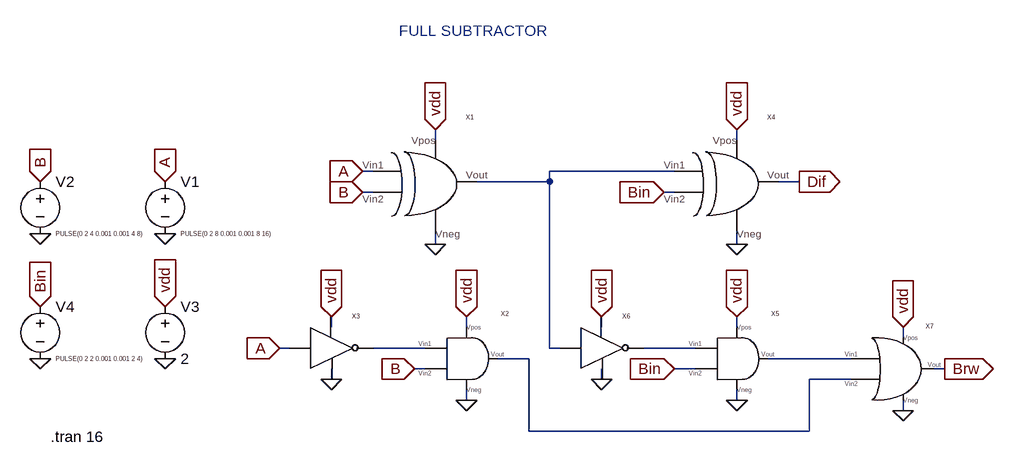
[diagram p0: schematic FULL SUB.asc]
FULL SUB.asc, the LTspice schematic file:
Version 4
SHEET 1 1320 680
WIRE 352 -80 352 -96
WIRE 816 -80 816 -96
WIRE 256 -32 240 -32
WIRE 720 -32 528 -32
WIRE 528 -16 528 -32
WIRE 528 -16 416 -16
WIRE 912 -16 880 -16
WIRE 256 0 240 0
WIRE 720 0 704 0
WIRE 352 80 352 64
WIRE 816 80 816 64
WIRE 192 208 192 192
WIRE 400 208 400 192
WIRE 608 208 608 192
WIRE 816 208 816 192
WIRE 1072 224 1072 208
WIRE 128 240 112 240
WIRE 336 240 256 240
WIRE 528 240 528 -16
WIRE 544 240 528 240
WIRE 752 240 672 240
WIRE 496 256 448 256
WIRE 992 256 864 256
WIRE 336 272 320 272
WIRE 752 272 720 272
WIRE 1136 272 1120 272
WIRE 192 288 192 272
WIRE 608 288 608 272
WIRE 992 288 928 288
WIRE 400 320 400 304
WIRE 816 320 816 304
WIRE 1072 336 1072 320
WIRE 496 368 496 256
WIRE 928 368 928 288
WIRE 928 368 496 368
FLAG 240 -32 A
IOPIN 240 -32 In
FLAG -64 -16 A
IOPIN -64 -16 In
FLAG 112 240 A
IOPIN 112 240 In
FLAG 240 0 B
IOPIN 240 0 In
FLAG -256 -16 B
IOPIN -256 -16 In
FLAG 320 272 B
IOPIN 320 272 In
FLAG 352 -96 vdd
IOPIN 352 -96 In
FLAG -64 176 vdd
IOPIN -64 176 In
FLAG 400 192 vdd
IOPIN 400 192 In
FLAG 192 192 vdd
IOPIN 192 192 In
FLAG 352 80 0
FLAG 400 320 0
FLAG 192 288 0
FLAG -64 256 0
FLAG -256 64 0
FLAG -64 64 0
FLAG 816 -96 vdd
IOPIN 816 -96 In
FLAG 816 192 vdd
IOPIN 816 192 In
FLAG 608 192 vdd
IOPIN 608 192 In
FLAG 816 80 0
FLAG 816 320 0
FLAG 608 288 0
FLAG 912 -16 Dif
IOPIN 912 -16 Out
FLAG -256 256 0
FLAG -256 176 Bin
IOPIN -256 176 In
FLAG 704 0 Bin
IOPIN 704 0 In
FLAG 720 272 Bin
IOPIN 720 272 In
FLAG 1072 208 vdd
IOPIN 1072 208 In
FLAG 1136 272 Brw
IOPIN 1136 272 Out
FLAG 1072 336 0
SYMBOL xor 400 -32 R0
SYMATTR InstName X1
SYMBOL and 432 256 R0
SYMATTR InstName X2
SYMBOL inverter 192 256 R0
SYMATTR InstName X3
SYMBOL voltage -64 -32 R0
WINDOW 3 24 96 Left 0
WINDOW 123 0 0 Left 0
WINDOW 39 0 0 Left 0
SYMATTR Value PULSE(0 2 8 0.001 0.001 8 16)
SYMATTR InstName V1
SYMBOL voltage -256 -32 R0
WINDOW 3 24 96 Left 0
WINDOW 123 0 0 Left 0
WINDOW 39 0 0 Left 0
SYMATTR Value PULSE(0 2 4 0.001 0.001 4 8)
SYMATTR InstName V2
SYMBOL voltage -64 160 R0
WINDOW 123 0 0 Left 0
WINDOW 39 0 0 Left 0
SYMATTR InstName V3
SYMATTR Value 2
SYMBOL xor 864 -32 R0
SYMATTR InstName X4
SYMBOL and 848 256 R0
SYMATTR InstName X5
SYMBOL inverter 608 256 R0
SYMATTR InstName X6
SYMBOL voltage -256 160 R0
WINDOW 3 24 96 Left 0
WINDOW 123 0 0 Left 0
WINDOW 39 0 0 Left 0
SYMATTR Value PULSE(0 2 2 0.001 0.001 2 4)
SYMATTR InstName V4
SYMBOL or 816 272 R0
SYMATTR InstName X7
TEXT -240 376 Left 2 !.tran 16
TEXT 296 -248 Left 2 ;FULL SUBTRACTOR

The netlist it stands for:
* FULL SUB.asc
XX1 A B vdd 0 N001 xor  ; pins A B vdd gnd Y
XX2 vdd N002 B 0 N004 and  ; pins vdd A B gnd Y
XX3 N002 vdd A 0 inverter  ; pins Y vdd A gnd
V1 A 0 PULSE(0 2 8 0.001 0.001 8 16)
V2 B 0 PULSE(0 2 4 0.001 0.001 4 8)
V3 vdd 0 2
XX4 N001 Bin vdd 0 Dif xor  ; pins A B vdd gnd Y
XX5 vdd N003 Bin 0 N005 and  ; pins vdd A B gnd Y
XX6 N003 vdd N001 0 inverter  ; pins Y vdd A gnd
V4 Bin 0 PULSE(0 2 2 0.001 0.001 2 4)
XX7 vdd N005 N004 0 Brw or  ; pins vdd A B gnd Y
.tran 16
* FULL SUBTRACTOR
.backanno
.end

* Results of the author's LTspice run, read from the files saved beside the schematic
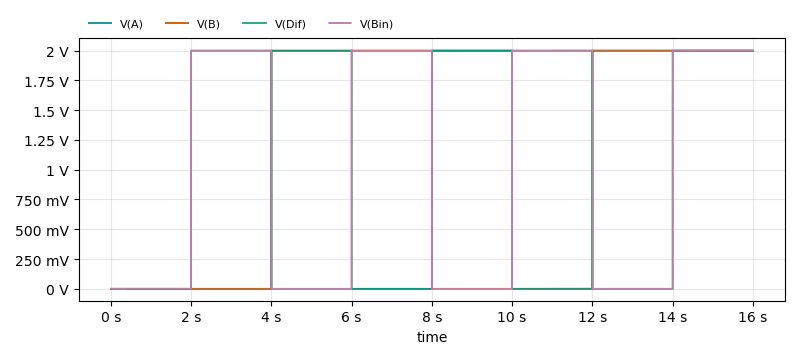
[diagram p1: Transient Analysis of FULL SUB.asc, plotted from the saved traces]
* Transient Analysis, 1 run:
*   V(A): min 0 V, max 2 V, average 999.9 mV, rms 1.414 V, last 2 V
*   V(B): min 0 V, max 2 V, average 1 V, rms 1.414 V, last 2 V
*   V(Dif): min -7.653 µV, max 2 V, average 999.9 mV, rms 1.414 V, last 2 V
*   V(Bin): min 0 V, max 2.002 V, average 1 V, rms 1.414 V, last 2 V